# EAGLE design Callisto_Teknic_MSO_LED_out (EAGLE 9.6.2)
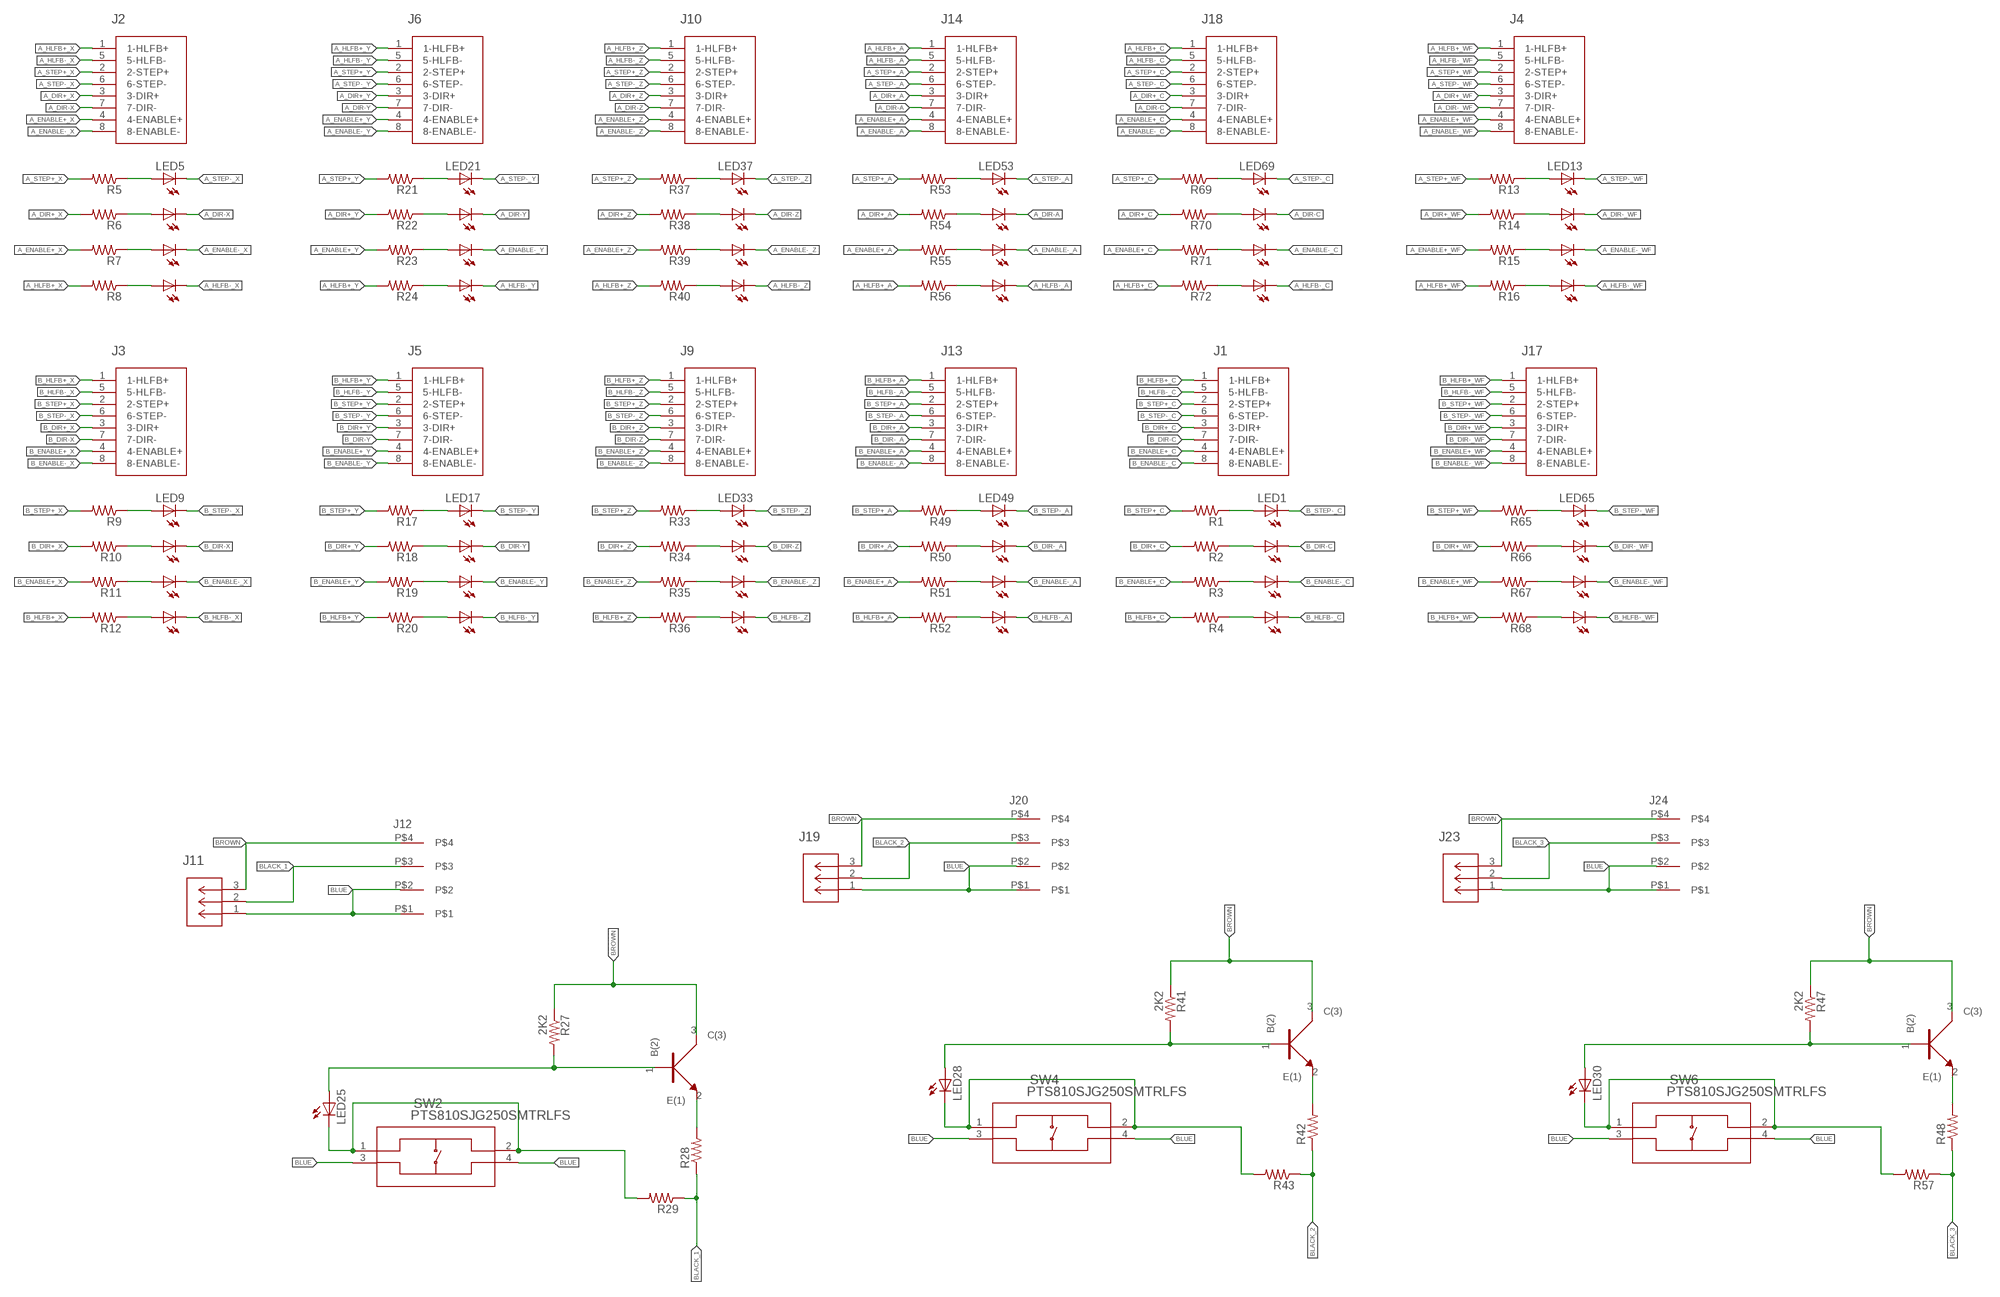
[diagram p0: schematic, sheet 1, part 1 of 2]
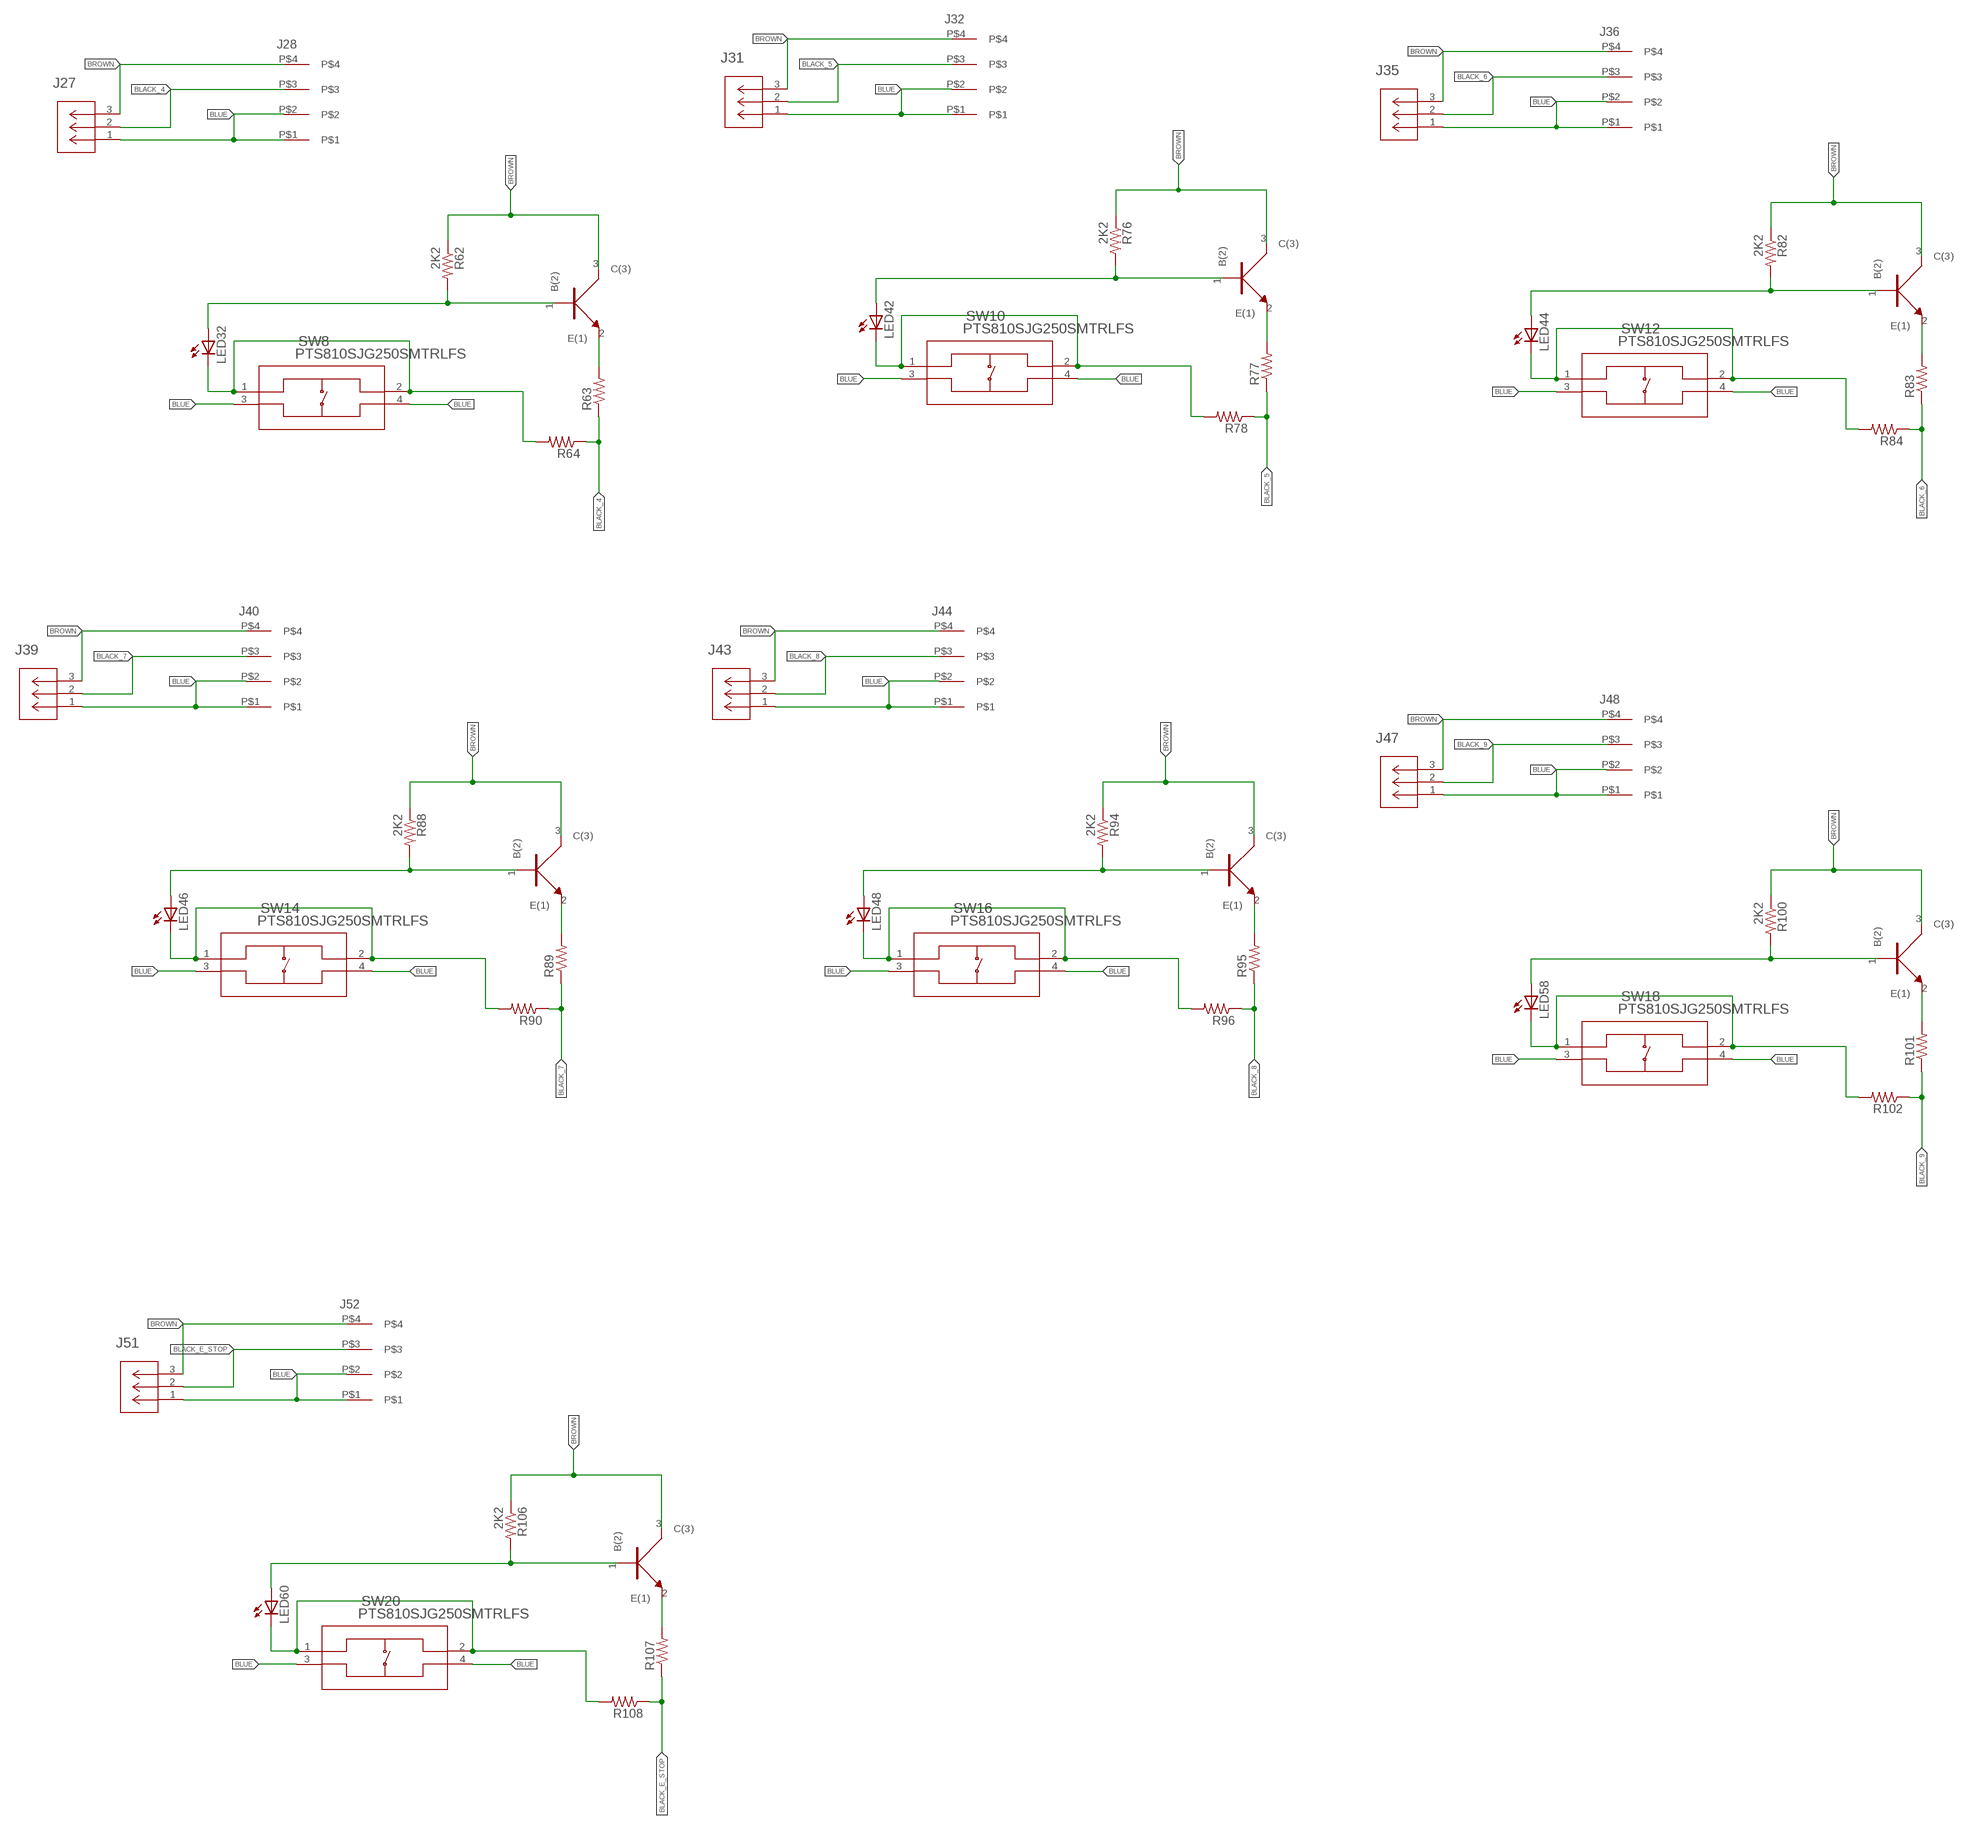
[diagram p1: schematic, sheet 1, part 2 of 2]

## Parts
J1  TEKNIC_MOTOR_SD_8PIN  [CON_39281083]
J2  TEKNIC_MOTOR_SD_8PIN  [CON_39281083]
J3  TEKNIC_MOTOR_SD_8PIN  [CON_39281083]
J4  TEKNIC_MOTOR_SD_8PIN  [CON_39281083]
J5  TEKNIC_MOTOR_SD_8PIN  [CON_39281083]
J6  TEKNIC_MOTOR_SD_8PIN  [CON_39281083]
J9  TEKNIC_MOTOR_SD_8PIN  [CON_39281083]
J10  TEKNIC_MOTOR_SD_8PIN  [CON_39281083]
J11  CONN_530470310_PICOBLADE_X_3  [CON_530470310_MOL]
J12  4-pos  3.81MM_1_X_4_RT_ANGLE_PLUG_HEADER  [1X4_3.81MM_PITCH]
J13  TEKNIC_MOTOR_SD_8PIN  [CON_39281083]
J14  TEKNIC_MOTOR_SD_8PIN  [CON_39281083]
J17  TEKNIC_MOTOR_SD_8PIN  [CON_39281083]
J18  TEKNIC_MOTOR_SD_8PIN  [CON_39281083]
J19  CONN_530470310_PICOBLADE_X_3  [CON_530470310_MOL]
J20  4-pos  3.81MM_1_X_4_RT_ANGLE_PLUG_HEADER  [1X4_3.81MM_PITCH]
J23  CONN_530470310_PICOBLADE_X_3  [CON_530470310_MOL]
J24  4-pos  3.81MM_1_X_4_RT_ANGLE_PLUG_HEADER  [1X4_3.81MM_PITCH]
J27  CONN_530470310_PICOBLADE_X_3  [CON_530470310_MOL]
J28  4-pos  3.81MM_1_X_4_RT_ANGLE_PLUG_HEADER  [1X4_3.81MM_PITCH]
J31  CONN_530470310_PICOBLADE_X_3  [CON_530470310_MOL]
J32  4-pos  3.81MM_1_X_4_RT_ANGLE_PLUG_HEADER  [1X4_3.81MM_PITCH]
J35  CONN_530470310_PICOBLADE_X_3  [CON_530470310_MOL]
J36  4-pos  3.81MM_1_X_4_RT_ANGLE_PLUG_HEADER  [1X4_3.81MM_PITCH]
J39  CONN_530470310_PICOBLADE_X_3  [CON_530470310_MOL]
J40  4-pos  3.81MM_1_X_4_RT_ANGLE_PLUG_HEADER  [1X4_3.81MM_PITCH]
J43  CONN_530470310_PICOBLADE_X_3  [CON_530470310_MOL]
J44  4-pos  3.81MM_1_X_4_RT_ANGLE_PLUG_HEADER  [1X4_3.81MM_PITCH]
J47  CONN_530470310_PICOBLADE_X_3  [CON_530470310_MOL]
J48  4-pos  3.81MM_1_X_4_RT_ANGLE_PLUG_HEADER  [1X4_3.81MM_PITCH]
J51  CONN_530470310_PICOBLADE_X_3  [CON_530470310_MOL]
J52  4-pos  3.81MM_1_X_4_RT_ANGLE_PLUG_HEADER  [1X4_3.81MM_PITCH]
LED1  Green  LED_0805_GREEN  [0805]
LED2  Green  LED_0805_GREEN  [0805]
LED3  Green  LED_0805_GREEN  [0805]
LED4  Green  LED_0805_GREEN  [0805]
LED5  Green  LED_0805_GREEN  [0805]
LED6  Green  LED_0805_GREEN  [0805]
LED7  Green  LED_0805_GREEN  [0805]
LED8  Green  LED_0805_GREEN  [0805]
LED9  Green  LED_0805_GREEN  [0805]
LED10  Green  LED_0805_GREEN  [0805]
LED11  Green  LED_0805_GREEN  [0805]
LED12  Green  LED_0805_GREEN  [0805]
LED13  Green  LED_0805_GREEN  [0805]
LED14  Green  LED_0805_GREEN  [0805]
LED15  Green  LED_0805_GREEN  [0805]
LED16  Green  LED_0805_GREEN  [0805]
LED17  Green  LED_0805_GREEN  [0805]
LED18  Green  LED_0805_GREEN  [0805]
LED19  Green  LED_0805_GREEN  [0805]
LED20  Green  LED_0805_GREEN  [0805]
LED21  Green  LED_0805_GREEN  [0805]
LED22  Green  LED_0805_GREEN  [0805]
LED23  Green  LED_0805_GREEN  [0805]
LED24  Green  LED_0805_GREEN  [0805]
LED25  Green  LED_0805_GREEN  [0805]
LED28  Green  LED_0805_GREEN  [0805]
LED30  Green  LED_0805_GREEN  [0805]
LED32  Green  LED_0805_GREEN  [0805]
LED33  Green  LED_0805_GREEN  [0805]
LED34  Green  LED_0805_GREEN  [0805]
LED35  Green  LED_0805_GREEN  [0805]
LED36  Green  LED_0805_GREEN  [0805]
LED37  Green  LED_0805_GREEN  [0805]
LED38  Green  LED_0805_GREEN  [0805]
LED39  Green  LED_0805_GREEN  [0805]
LED40  Green  LED_0805_GREEN  [0805]
LED42  Green  LED_0805_GREEN  [0805]
LED44  Green  LED_0805_GREEN  [0805]
LED46  Green  LED_0805_GREEN  [0805]
LED48  Green  LED_0805_GREEN  [0805]
LED49  Green  LED_0805_GREEN  [0805]
LED50  Green  LED_0805_GREEN  [0805]
LED51  Green  LED_0805_GREEN  [0805]
LED52  Green  LED_0805_GREEN  [0805]
LED53  Green  LED_0805_GREEN  [0805]
LED54  Green  LED_0805_GREEN  [0805]
LED55  Green  LED_0805_GREEN  [0805]
LED56  Green  LED_0805_GREEN  [0805]
LED58  Green  LED_0805_GREEN  [0805]
LED60  Green  LED_0805_GREEN  [0805]
LED65  Green  LED_0805_GREEN  [0805]
LED66  Green  LED_0805_GREEN  [0805]
LED67  Green  LED_0805_GREEN  [0805]
LED68  Green  LED_0805_GREEN  [0805]
LED69  Green  LED_0805_GREEN  [0805]
LED70  Green  LED_0805_GREEN  [0805]
LED71  Green  LED_0805_GREEN  [0805]
LED72  Green  LED_0805_GREEN  [0805]
R1  R_0805  [0805]
R2  R_0805  [0805]
R3  R_0805  [0805]
R4  R_0805  [0805]
R5  R_0805  [0805]
R6  R_0805  [0805]
R7  R_0805  [0805]
R8  R_0805  [0805]
R9  R_0805  [0805]
R10  R_0805  [0805]
R11  R_0805  [0805]
R12  R_0805  [0805]
R13  R_0805  [0805]
R14  R_0805  [0805]
R15  R_0805  [0805]
R16  R_0805  [0805]
R17  R_0805  [0805]
R18  R_0805  [0805]
R19  R_0805  [0805]
R20  R_0805  [0805]
R21  R_0805  [0805]
R22  R_0805  [0805]
R23  R_0805  [0805]
R24  R_0805  [0805]
R27  2K2  R_0402  [0402]
R28  R_0402  [0402]
R29  R_0402  [0402]
R33  R_0805  [0805]
R34  R_0805  [0805]
R35  R_0805  [0805]
R36  R_0805  [0805]
R37  R_0805  [0805]
R38  R_0805  [0805]
R39  R_0805  [0805]
R40  R_0805  [0805]
R41  2K2  R_0402  [0402]
R42  R_0402  [0402]
R43  R_0402  [0402]
R47  2K2  R_0402  [0402]
R48  R_0402  [0402]
R49  R_0805  [0805]
R50  R_0805  [0805]
R51  R_0805  [0805]
R52  R_0805  [0805]
R53  R_0805  [0805]
R54  R_0805  [0805]
R55  R_0805  [0805]
R56  R_0805  [0805]
R57  R_0402  [0402]
R62  2K2  R_0402  [0402]
R63  R_0402  [0402]
R64  R_0402  [0402]
R65  R_0805  [0805]
R66  R_0805  [0805]
R67  R_0805  [0805]
R68  R_0805  [0805]
R69  R_0805  [0805]
R70  R_0805  [0805]
R71  R_0805  [0805]
R72  R_0805  [0805]
R76  2K2  R_0402  [0402]
R77  R_0402  [0402]
R78  R_0402  [0402]
R82  2K2  R_0402  [0402]
R83  R_0402  [0402]
R84  R_0402  [0402]
R88  2K2  R_0402  [0402]
R89  R_0402  [0402]
R90  R_0402  [0402]
R94  2K2  R_0402  [0402]
R95  R_0402  [0402]
R96  R_0402  [0402]
R100  2K2  R_0402  [0402]
R101  R_0402  [0402]
R102  R_0402  [0402]
R106  2K2  R_0402  [0402]
R107  R_0402  [0402]
R108  R_0402  [0402]
SW2  PTS810SJG250SMTRLFS  [PTS810]
SW4  PTS810SJG250SMTRLFS  [PTS810]
SW6  PTS810SJG250SMTRLFS  [PTS810]
SW8  PTS810SJG250SMTRLFS  [PTS810]
SW10  PTS810SJG250SMTRLFS  [PTS810]
SW12  PTS810SJG250SMTRLFS  [PTS810]
SW14  PTS810SJG250SMTRLFS  [PTS810]
SW16  PTS810SJG250SMTRLFS  [PTS810]
SW18  PTS810SJG250SMTRLFS  [PTS810]
SW20  PTS810SJG250SMTRLFS  [PTS810]
U1  NPN  BC846BW  [SOT323]
U3  NPN  BC846BW  [SOT323]
U5  NPN  BC846BW  [SOT323]
U7  NPN  BC846BW  [SOT323]
U9  NPN  BC846BW  [SOT323]
U11  NPN  BC846BW  [SOT323]
U13  NPN  BC846BW  [SOT323]
U15  NPN  BC846BW  [SOT323]
U17  NPN  BC846BW  [SOT323]
U20  NPN  BC846BW  [SOT323]

## Nets
A_DIR+_A: J14.3(3-DIR+) R54.2
A_DIR+_C: J18.3(3-DIR+) R70.2
A_DIR+_WF: J4.3(3-DIR+) R14.2
A_DIR+_X: J2.3(3-DIR+) R6.2
A_DIR+_Y: J6.3(3-DIR+) R22.2
A_DIR+_Z: J10.3(3-DIR+) R38.2
A_DIR-_WF: J4.7(7-DIR-) LED14.2(C)
A_DIR-A: J14.7(7-DIR-) LED54.2(C)
A_DIR-C: J18.7(7-DIR-) LED70.2(C)
A_DIR-X: J2.7(7-DIR-) LED6.2(C)
A_DIR-Y: J6.7(7-DIR-) LED22.2(C)
A_DIR-Z: J10.7(7-DIR-) LED38.2(C)
A_ENABLE+_A: J14.4(4-ENABLE+) R55.2
A_ENABLE+_C: J18.4(4-ENABLE+) R71.2
A_ENABLE+_WF: J4.4(4-ENABLE+) R15.2
A_ENABLE+_X: J2.4(4-ENABLE+) R7.2
A_ENABLE+_Y: J6.4(4-ENABLE+) R23.2
A_ENABLE+_Z: J10.4(4-ENABLE+) R39.2
A_ENABLE-_A: J14.8(8-ENABLE-) LED55.2(C)
A_ENABLE-_C: J18.8(8-ENABLE-) LED71.2(C)
A_ENABLE-_WF: J4.8(8-ENABLE-) LED15.2(C)
A_ENABLE-_X: J2.8(8-ENABLE-) LED7.2(C)
A_ENABLE-_Y: J6.8(8-ENABLE-) LED23.2(C)
A_ENABLE-_Z: J10.8(8-ENABLE-) LED39.2(C)
A_HLFB+_A: J14.1(1-HLFB+) R56.2
A_HLFB+_C: J18.1(1-HLFB+) R72.2
A_HLFB+_WF: J4.1(1-HLFB+) R16.2
A_HLFB+_X: J2.1(1-HLFB+) R8.2
A_HLFB+_Y: J6.1(1-HLFB+) R24.2
A_HLFB+_Z: J10.1(1-HLFB+) R40.2
A_HLFB-_A: J14.5(5-HLFB-) LED56.2(C)
A_HLFB-_C: J18.5(5-HLFB-) LED72.2(C)
A_HLFB-_WF: J4.5(5-HLFB-) LED16.2(C)
A_HLFB-_X: J2.5(5-HLFB-) LED8.2(C)
A_HLFB-_Y: J6.5(5-HLFB-) LED24.2(C)
A_HLFB-_Z: J10.5(5-HLFB-) LED40.2(C)
A_STEP+_A: J14.2(2-STEP+) R53.2
A_STEP+_C: J18.2(2-STEP+) R69.2
A_STEP+_WF: J4.2(2-STEP+) R13.2
A_STEP+_X: J2.2(2-STEP+) R5.2
A_STEP+_Y: J6.2(2-STEP+) R21.2
A_STEP+_Z: J10.2(2-STEP+) R37.2
A_STEP-_A: J14.6(6-STEP-) LED53.2(C)
A_STEP-_C: J18.6(6-STEP-) LED69.2(C)
A_STEP-_WF: J4.6(6-STEP-) LED13.2(C)
A_STEP-_X: J2.6(6-STEP-) LED5.2(C)
A_STEP-_Y: J6.6(6-STEP-) LED21.2(C)
A_STEP-_Z: J10.6(6-STEP-) LED37.2(C)
B_DIR+_A: J13.3(3-DIR+) R50.2
B_DIR+_C: J1.3(3-DIR+) R2.2
B_DIR+_WF: J17.3(3-DIR+) R66.2
B_DIR+_X: J3.3(3-DIR+) R10.2
B_DIR+_Y: J5.3(3-DIR+) R18.2
B_DIR+_Z: J9.3(3-DIR+) R34.2
B_DIR-_A: J13.7(7-DIR-) LED50.2(C)
B_DIR-_WF: J17.7(7-DIR-) LED66.2(C)
B_DIR-C: J1.7(7-DIR-) LED2.2(C)
B_DIR-X: J3.7(7-DIR-) LED10.2(C)
B_DIR-Y: J5.7(7-DIR-) LED18.2(C)
B_DIR-Z: J9.7(7-DIR-) LED34.2(C)
B_ENABLE+_A: J13.4(4-ENABLE+) R51.2
B_ENABLE+_C: J1.4(4-ENABLE+) R3.2
B_ENABLE+_WF: J17.4(4-ENABLE+) R67.2
B_ENABLE+_X: J3.4(4-ENABLE+) R11.2
B_ENABLE+_Y: J5.4(4-ENABLE+) R19.2
B_ENABLE+_Z: J9.4(4-ENABLE+) R35.2
B_ENABLE-_A: J13.8(8-ENABLE-) LED51.2(C)
B_ENABLE-_C: J1.8(8-ENABLE-) LED3.2(C)
B_ENABLE-_WF: J17.8(8-ENABLE-) LED67.2(C)
B_ENABLE-_X: J3.8(8-ENABLE-) LED11.2(C)
B_ENABLE-_Y: J5.8(8-ENABLE-) LED19.2(C)
B_ENABLE-_Z: J9.8(8-ENABLE-) LED35.2(C)
B_HLFB+_A: J13.1(1-HLFB+) R52.2
B_HLFB+_C: J1.1(1-HLFB+) R4.2
B_HLFB+_WF: J17.1(1-HLFB+) R68.2
B_HLFB+_X: J3.1(1-HLFB+) R12.2
B_HLFB+_Y: J5.1(1-HLFB+) R20.2
B_HLFB+_Z: J9.1(1-HLFB+) R36.2
B_HLFB-_A: J13.5(5-HLFB-) LED52.2(C)
B_HLFB-_C: J1.5(5-HLFB-) LED4.2(C)
B_HLFB-_WF: J17.5(5-HLFB-) LED68.2(C)
B_HLFB-_X: J3.5(5-HLFB-) LED12.2(C)
B_HLFB-_Y: J5.5(5-HLFB-) LED20.2(C)
B_HLFB-_Z: J9.5(5-HLFB-) LED36.2(C)
B_STEP+_A: J13.2(2-STEP+) R49.2
B_STEP+_C: J1.2(2-STEP+) R1.2
B_STEP+_WF: J17.2(2-STEP+) R65.2
B_STEP+_X: J3.2(2-STEP+) R9.2
B_STEP+_Y: J5.2(2-STEP+) R17.2
B_STEP+_Z: J9.2(2-STEP+) R33.2
B_STEP-_A: J13.6(6-STEP-) LED49.2(C)
B_STEP-_C: J1.6(6-STEP-) LED1.2(C)
B_STEP-_WF: J17.6(6-STEP-) LED65.2(C)
B_STEP-_X: J3.6(6-STEP-) LED9.2(C)
B_STEP-_Y: J5.6(6-STEP-) LED17.2(C)
B_STEP-_Z: J9.6(6-STEP-) LED33.2(C)
BLACK_1: J11.2 J12.P$3 R28.P$1 R29.P$1
BLACK_2: J19.2 J20.P$3 R42.P$1 R43.P$1
BLACK_3: J23.2 J24.P$3 R48.P$1 R57.P$1
BLACK_4: J27.2 J28.P$3 R63.P$1 R64.P$1
BLACK_5: J31.2 J32.P$3 R77.P$1 R78.P$1
BLACK_6: J35.2 J36.P$3 R83.P$1 R84.P$1
BLACK_7: J39.2 J40.P$3 R89.P$1 R90.P$1
BLACK_8: J43.2 J44.P$3 R95.P$1 R96.P$1
BLACK_9: J47.2 J48.P$3 R101.P$1 R102.P$1
BLACK_E_STOP: J51.2 J52.P$3 R107.P$1 R108.P$1
BLUE: J11.1 J12.P$1 J12.P$2 J19.1 J20.P$1 J20.P$2 J23.1 J24.P$1 J24.P$2 J27.1 J28.P$1 J28.P$2 J31.1 J32.P$1 J32.P$2 J35.1 J36.P$1 J36.P$2 J39.1 J40.P$1 J40.P$2 J43.1 J44.P$1 J44.P$2 J47.1 J48.P$1 J48.P$2 J51.1 J52.P$1 J52.P$2 SW2.3 SW2.4 SW4.3 SW4.4 SW6.3 SW6.4 SW8.3 SW8.4 SW10.3 SW10.4 SW12.3 SW12.4 SW14.3 SW14.4 SW16.3 SW16.4 SW18.3 SW18.4 SW20.3 SW20.4
BROWN: J11.3 J12.P$4 J19.3 J20.P$4 J23.3 J24.P$4 J27.3 J28.P$4 J31.3 J32.P$4 J35.3 J36.P$4 J39.3 J40.P$4 J43.3 J44.P$4 J47.3 J48.P$4 J51.3 J52.P$4 R27.P$1 R41.P$1 R47.P$1 R62.P$1 R76.P$1 R82.P$1 R88.P$1 R94.P$1 R100.P$1 R106.P$1 U1.3(C(3)) U3.3(C(3)) U5.3(C(3)) U7.3(C(3)) U9.3(C(3)) U11.3(C(3)) U13.3(C(3)) U15.3(C(3)) U17.3(C(3)) U20.3(C(3))
N$1: LED1.1(A) R1.1
N$2: LED2.1(A) R2.1
N$3: LED3.1(A) R3.1
N$4: LED4.1(A) R4.1
N$5: LED5.1(A) R5.1
N$6: LED6.1(A) R6.1
N$7: LED7.1(A) R7.1
N$8: LED8.1(A) R8.1
N$9: LED9.1(A) R9.1
N$10: LED10.1(A) R10.1
N$11: LED11.1(A) R11.1
N$12: LED12.1(A) R12.1
N$13: LED13.1(A) R13.1
N$14: LED14.1(A) R14.1
N$15: LED15.1(A) R15.1
N$16: LED16.1(A) R16.1
N$17: LED17.1(A) R17.1
N$18: LED18.1(A) R18.1
N$19: LED19.1(A) R19.1
N$20: LED20.1(A) R20.1
N$21: LED21.1(A) R21.1
N$22: LED22.1(A) R22.1
N$23: LED23.1(A) R23.1
N$24: LED24.1(A) R24.1
N$28: LED25.1(A) R27.P$2 U1.1(B(2))
N$29: LED25.2(C) R29.P$2 SW2.1 SW2.2
N$30: R28.P$2 U1.2(E(1))
N$33: LED33.1(A) R33.1
N$34: LED34.1(A) R34.1
N$35: LED35.1(A) R35.1
N$36: LED36.1(A) R36.1
N$37: LED37.1(A) R37.1
N$38: LED38.1(A) R38.1
N$39: LED39.1(A) R39.1
N$40: LED40.1(A) R40.1
N$42: LED28.1(A) R41.P$2 U3.1(B(2))
N$43: LED28.2(C) R43.P$2 SW4.1 SW4.2
N$44: R42.P$2 U3.2(E(1))
N$48: LED30.1(A) R47.P$2 U5.1(B(2))
N$49: LED49.1(A) R49.1
N$50: LED50.1(A) R50.1
N$51: LED51.1(A) R51.1
N$52: LED52.1(A) R52.1
N$53: LED53.1(A) R53.1
N$54: LED54.1(A) R54.1
N$55: LED55.1(A) R55.1
N$56: LED56.1(A) R56.1
N$57: LED30.2(C) R57.P$2 SW6.1 SW6.2
N$58: R48.P$2 U5.2(E(1))
N$62: LED32.1(A) R62.P$2 U7.1(B(2))
N$63: LED32.2(C) R64.P$2 SW8.1 SW8.2
N$64: R63.P$2 U7.2(E(1))
N$65: LED65.1(A) R65.1
N$66: LED66.1(A) R66.1
N$67: LED67.1(A) R67.1
N$68: LED68.1(A) R68.1
N$69: LED69.1(A) R69.1
N$70: LED70.1(A) R70.1
N$71: LED71.1(A) R71.1
N$72: LED72.1(A) R72.1
N$76: LED42.1(A) R76.P$2 U9.1(B(2))
N$77: LED42.2(C) R78.P$2 SW10.1 SW10.2
N$78: R77.P$2 U9.2(E(1))
N$82: LED44.1(A) R82.P$2 U11.1(B(2))
N$83: LED44.2(C) R84.P$2 SW12.1 SW12.2
N$84: R83.P$2 U11.2(E(1))
N$88: LED46.1(A) R88.P$2 U13.1(B(2))
N$89: LED46.2(C) R90.P$2 SW14.1 SW14.2
N$90: R89.P$2 U13.2(E(1))
N$94: LED48.1(A) R94.P$2 U15.1(B(2))
N$95: LED48.2(C) R96.P$2 SW16.1 SW16.2
N$96: R95.P$2 U15.2(E(1))
N$100: LED58.1(A) R100.P$2 U17.1(B(2))
N$101: LED58.2(C) R102.P$2 SW18.1 SW18.2
N$102: R101.P$2 U17.2(E(1))
N$106: LED60.1(A) R106.P$2 U20.1(B(2))
N$107: LED60.2(C) R108.P$2 SW20.1 SW20.2
N$108: R107.P$2 U20.2(E(1))

## Library data of the parts
J1-J6 J9 J10 J13 J14 J17 J18 = 3D_MIG_Controller:TEKNIC_MOTOR_SD_8PIN; COPYRIGHT: Copyright (C) 2022 Ultra Librarian. All rights reserved.; MANUFACTURER_PART_NUMBER: 39281083; MFR_NAME: Molex Connector Corporation
J11 J19 J23 J27 J31 J35 J39 J43 J47 J51 = 3D_MIG_Controller:CONN_530470310_PICOBLADE_X_3; COPYRIGHT: Copyright (C) 2022 Ultra Librarian. All rights reserved.; MANUFACTURER_PART_NUMBER: 530470310; MFR_NAME: Molex Connector Corporation
J12 J20 J24 J28 J32 J36 J40 J44 J48 J52 = 3D_MIG_Controller:3.81MM_1_X_4_RT_ANGLE_PLUG_HEADER: 4 Position Terminal Block Header, Male Pins, Shrouded (4 Side) 0.150" (3.81mm) 90°, Right Angle - Through Hole; PARTNO: 691322310004
LED1-LED25 LED28 LED30 LED32-LED40 LED42 LED44 LED46 LED48-LED56 LED58 LED60 LED65-LED72 = 3D_MIG_Controller:LED_0805_GREEN: Green 570nm LED Indication - Discrete 2.2V 0805 (2012 Metric); PARTNO: LG R971-KN-1
R1-R24 R33-R40 R49-R56 R65-R72 = 3D_MIG_Controller:R_0805
R27-R29 R41-R43 R47 R48 R57 R62-R64 R76-R78 R82-R84 R88-R90 R94-R96 R100-R102 R106-R108 = 3D_MIG_Controller:R_0402
SW2 SW4 SW6 SW8 SW10 SW12 SW14 SW16 SW18 SW20 = 3D_MIG_Controller:PTS810SJG250SMTRLFS; BUILT_BY: EMA_Cory; COPYRIGHT: Copyright (C) 2018 Accelerated Designs. All rights reserved; DATASHEET: https://www.ckswitches.com/products/tactile/PTS810/#PTS810SJG250SMTRLFS; MANUFACTURER_PART_NUMBER: PTS810SJG250SMTRLFS; VENDOR: C&K
U1 U3 U5 U7 U9 U11 U13 U15 U17 U20 = 3D_MIG_Controller:BC846BW: Bipolar (BJT) Transistor NPN 100MHz Surface Mount SOT-323; PARTNO: BC846BW_NPN

## Board
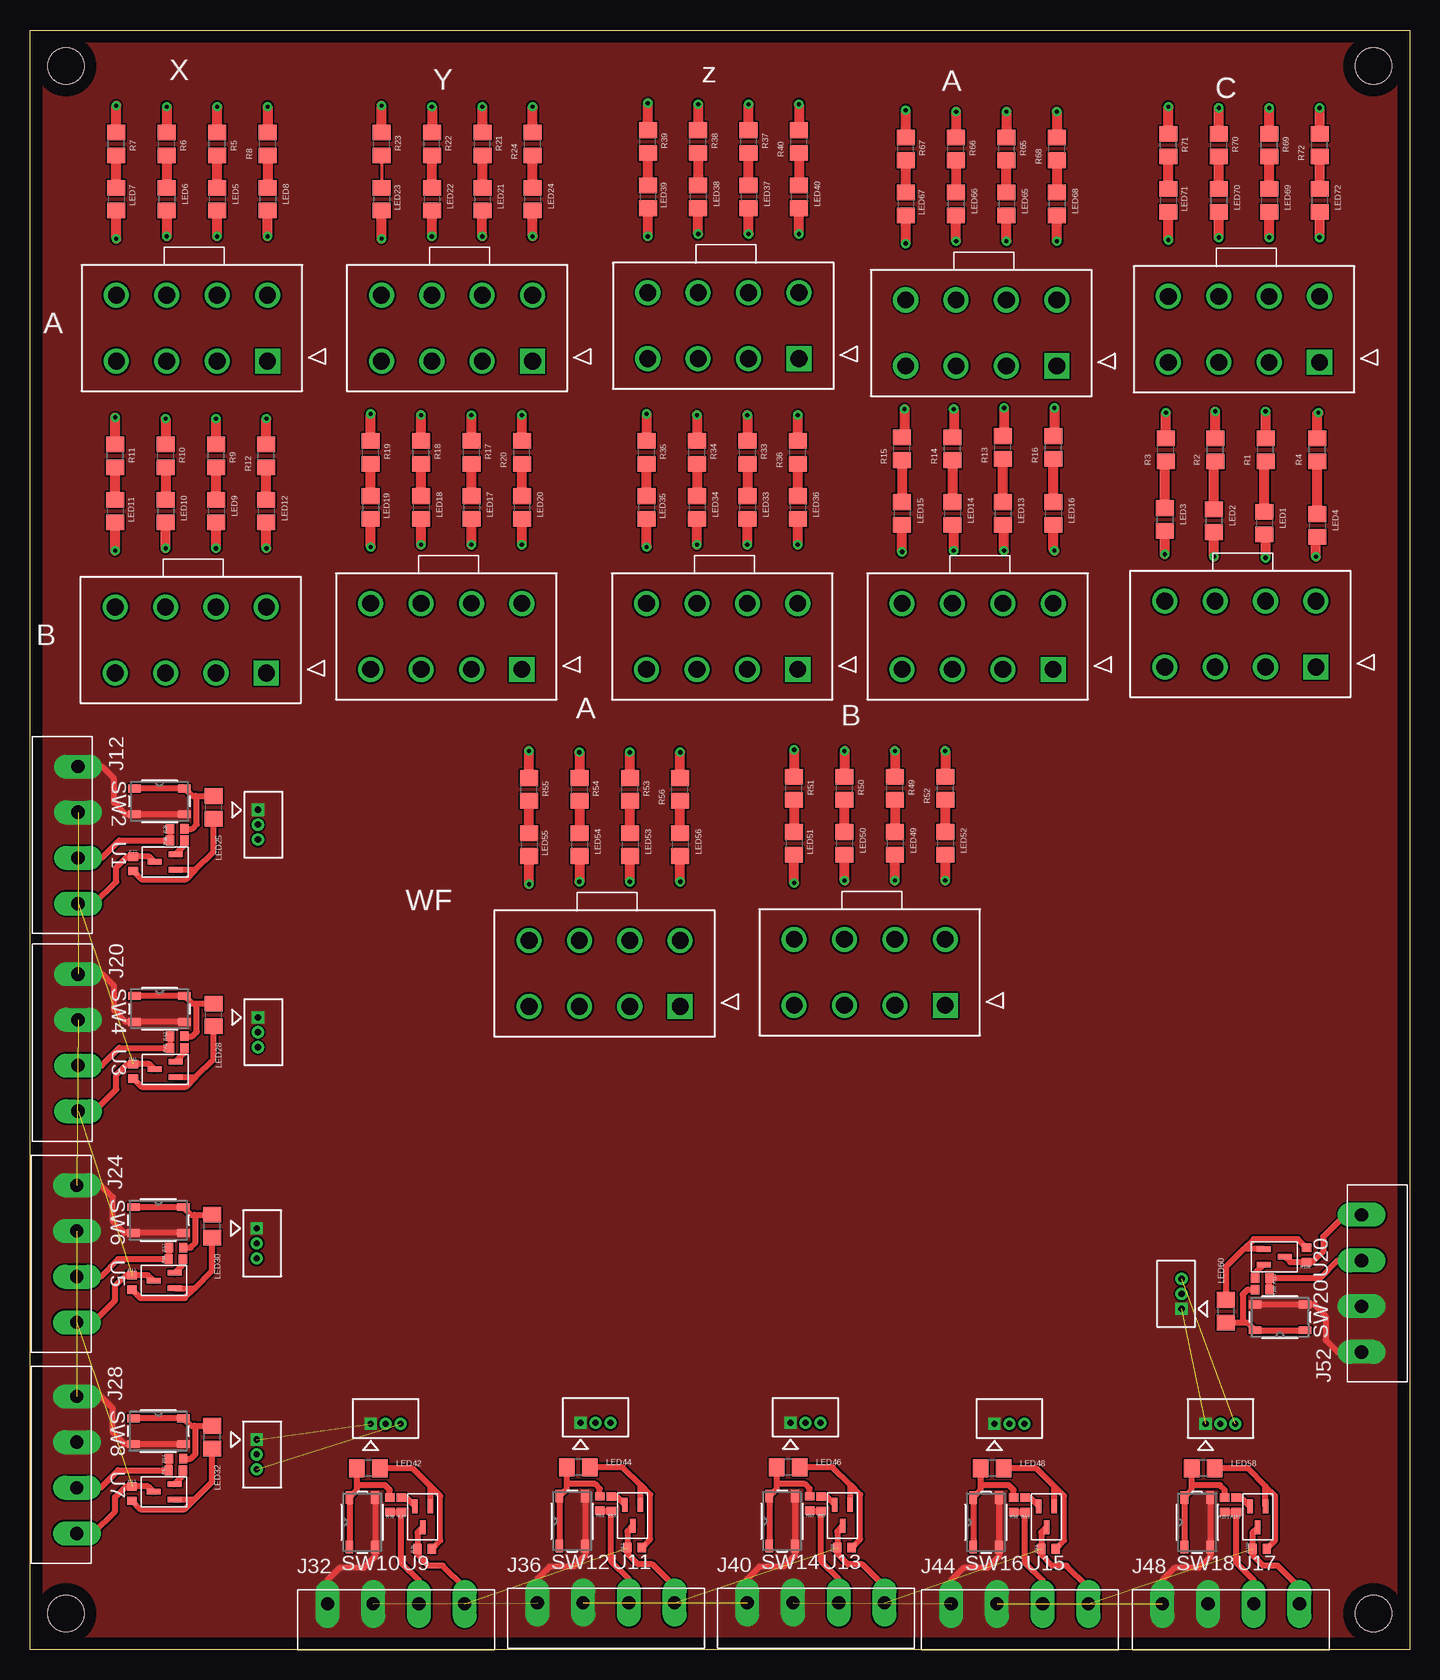
[diagram p2: board, top side]
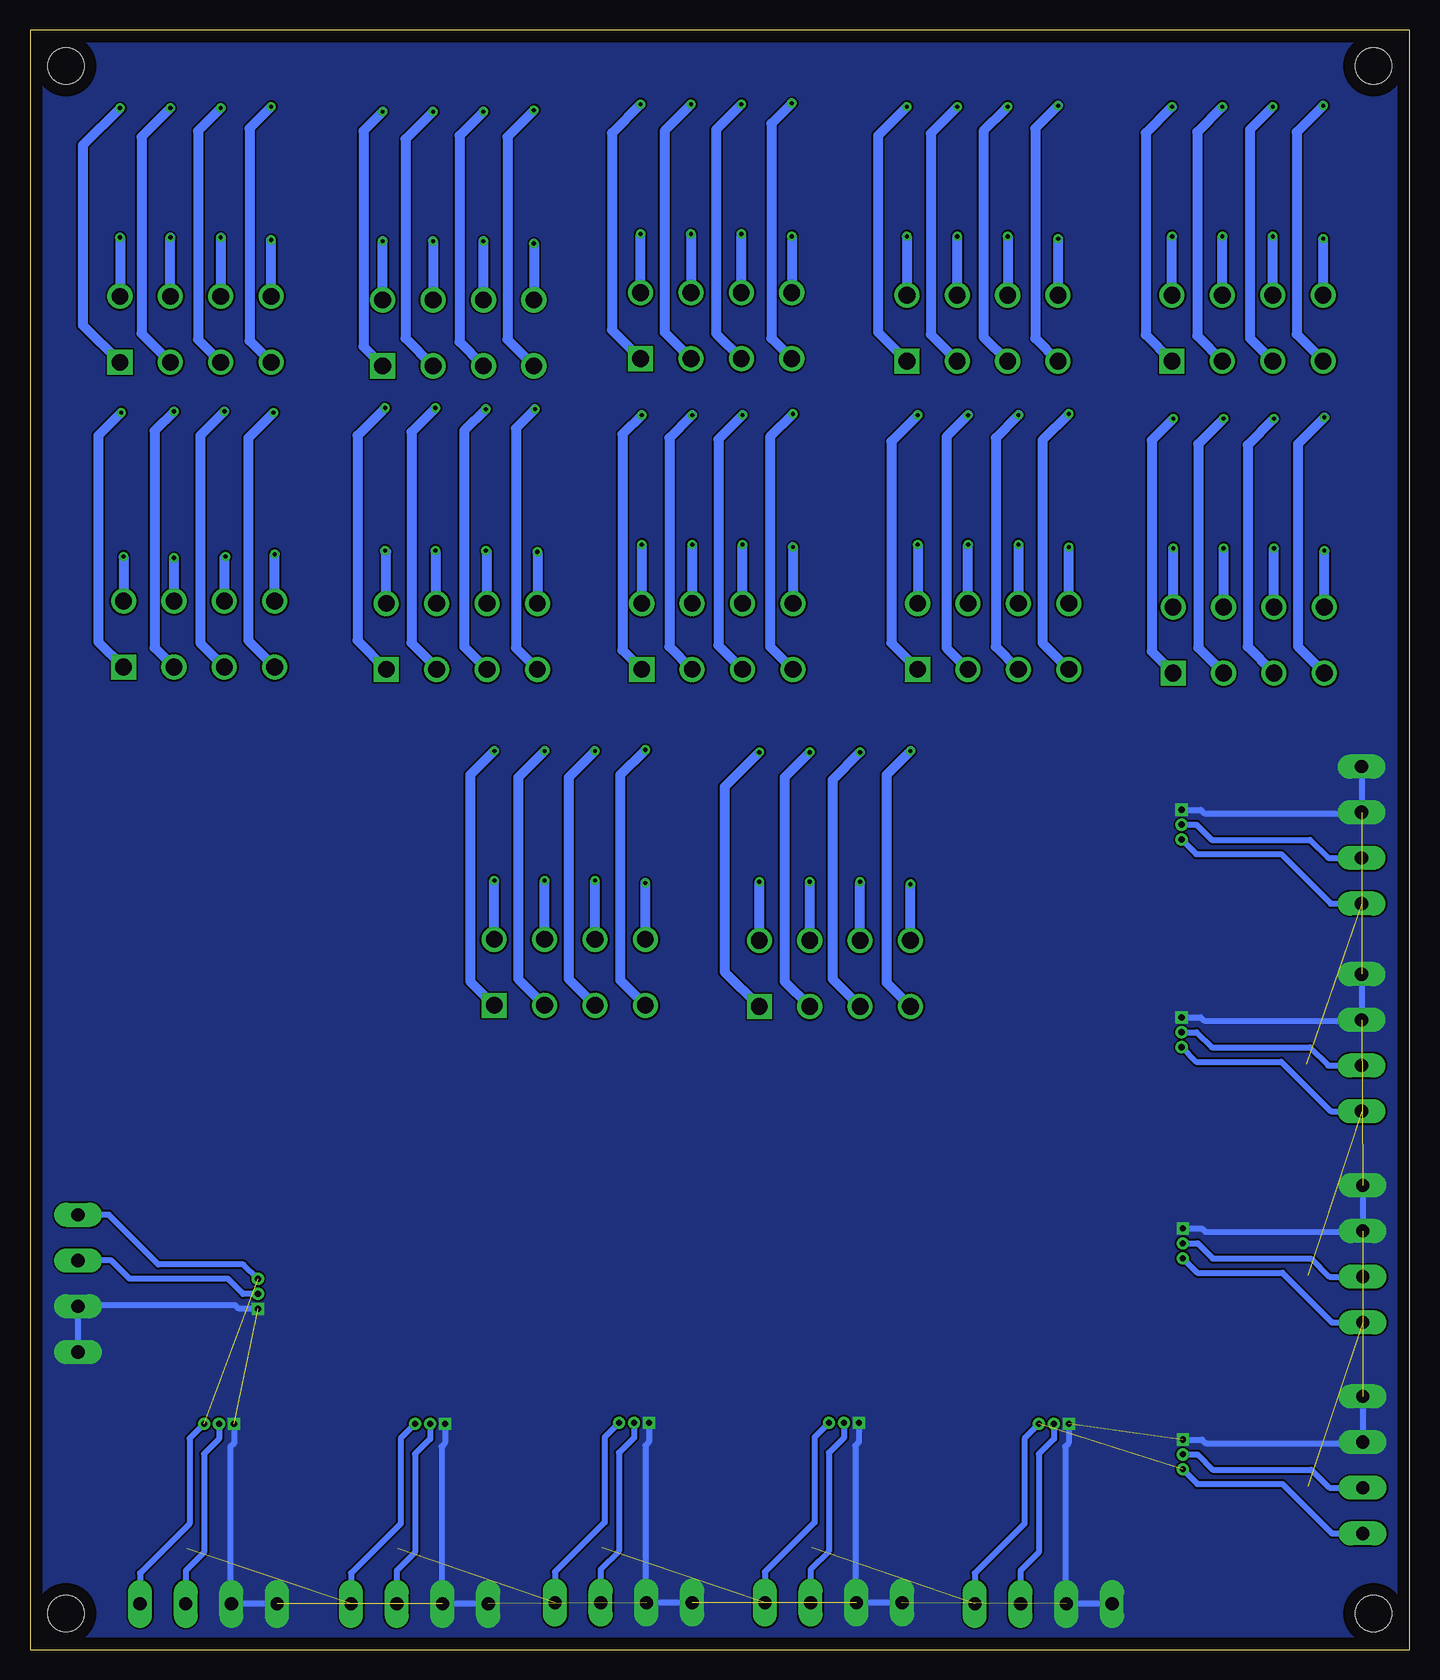
[diagram p3: board, bottom side, seen from below]

Size 115 x 135 mm. Coordinates in mm from the lower left corner, seen from the top.
Outline: 0,0 0,135 115,135 115,0 0,0
Copper layers (1*16): Top 0.035mm / dielectric 1.5mm / Bottom 0.035mm
Design rules "default": minimum track width 6mil, minimum drill 0.35mm, track to track 6mil, track to pad 6mil, pad to pad 6mil, via to via 6mil, smd to smd 6mil, copper to edge 40mil, drill to drill 6mil, minimum pad ring 10mil, minimum via ring 8mil, stop-mask expansion 4mil, vias tented up to drill 0mil, thermal gap 10mil
Holes 3 mm at 3,3 112,3 112,132 3,132

### Footprints (pad centres in the part's own frame; a part is rotated, then mirrored left to right if it is on the bottom)
CON_39281083 = drill 1.397 pad 1.905 square: 1 12.6,-5.5 | drill 1.397 pad 1.905: 2 8.4,-5.5; 3 4.2,-5.5; 4 0,-5.5; 5 12.6,0; 6 8.4,0; 7 4.2,0; 8 0,0
CON_530470310_MOL = drill 0.508 pad 0.838 square: 1 0,0 | drill 0.508 pad 0.838: 2 -1.245,0; 3 -2.489,0
1X4_3.81MM_PITCH = drill 1.1 pad 2 long: P$1 0,0; P$2 3.81,0; P$3 7.62,0; P$4 11.43,0
0805 = smd 1.3 x 1.5: 1 -0.95,0; 2 0.95,0
0402 = smd 0.8 x 0.7: P$1 0,0.6; P$2 0,-0.6
PTS810 = smd 1.041 x 0.66: 1 -2.075,1.075; 2 2.075,1.075; 3 -2.075,-1.075; 4 2.075,-1.075
SOT323 = smd 0.457 x 1.168: 1 -0.65,-0.876; 2 0.65,-0.876; 3 0,0.876

### Placement (x,y rotation side)
J1  94.6,87.4 0 top
J2  7.2,112.9 0 top
J3  7.1,86.9 0 top
J4  72.7,87.2 0 top
J5  28.4,87.2 0 top
J6  29.3,112.9 0 top
J9  51.4,87.2 0 top
J10  51.5,113.1 0 top
J11  19,70 90 top
J12  4,73.6 270 top
J13  63.7,59.2 0 top
J14  41.6,59.1 0 top
J17  73,112.5 0 top
J18  94.9,112.8 0 top
J19  19,52.7 90 top
J20  4,56.3 270 top
J23  18.9,35.1 90 top
J24  3.9,38.7 270 top
J27  18.9,17.5 90 top
J28  3.9,21.1 270 top
J31  28.4,18.8 180 top
J32  24.8,3.8 0 top
J35  45.9,18.9 180 top
J36  42.3,3.9 0 top
J39  63.4,18.9 180 top
J40  59.8,3.9 0 top
J43  80.4,18.8 180 top
J44  76.8,3.8 0 top
J47  98,18.8 180 top
J48  94.4,3.8 0 top
J51  96,28.4 270 top
J52  111,24.8 90 top
LED1  102.9,93.9 270 top
LED2  98.7,94.1 270 top
LED3  94.6,94.2 270 top
LED4  107.3,93.7 270 top
LED5  15.61,120.9 270 top
LED6  11.4,120.9 270 top
LED7  7.2,120.9 270 top
LED8  19.8,120.9 270 top
LED9  15.51,94.9 270 top
LED10  11.3,94.9 270 top
LED11  7.1,94.9 270 top
LED12  19.7,94.9 270 top
LED13  81.1,94.7 270 top
LED14  76.9,94.7 270 top
LED15  72.7,94.7 270 top
LED16  85.3,94.7 270 top
LED17  36.81,95.2 270 top
LED18  32.6,95.2 270 top
LED19  28.4,95.2 270 top
LED20  41,95.2 270 top
LED21  37.71,120.9 270 top
LED22  33.5,120.9 270 top
LED23  29.3,120.9 270 top
LED24  41.9,120.9 270 top
LED25  15.3,70.2 90 top
LED28  15.3,52.9 90 top
LED30  15.2,35.3 90 top
LED32  15.2,17.7 90 top
LED33  59.81,95.2 270 top
LED34  55.6,95.2 270 top
LED35  51.4,95.2 270 top
LED36  64,95.2 270 top
LED37  59.91,121.1 270 top
LED38  55.7,121.1 270 top
LED39  51.5,121.1 270 top
LED40  64.1,121.1 270 top
LED42  28.2,15.1 180 top
LED44  45.7,15.2 180 top
LED46  63.2,15.2 180 top
LED48  80.2,15.1 180 top
LED49  72.11,67.2 270 top
LED50  67.9,67.2 270 top
LED51  63.7,67.2 270 top
LED52  76.3,67.2 270 top
LED53  50.01,67.1 270 top
LED54  45.8,67.1 270 top
LED55  41.6,67.1 270 top
LED56  54.2,67.1 270 top
LED58  97.8,15.1 180 top
LED60  99.7,28.2 270 top
LED65  81.41,120.5 270 top
LED66  77.2,120.5 270 top
LED67  73,120.5 270 top
LED68  85.6,120.5 270 top
LED69  103.31,120.8 270 top
LED70  99.1,120.8 270 top
LED71  94.9,120.8 270 top
LED72  107.5,120.8 270 top
R1  103,100 90 top
R2  98.8,100 90 top
R3  94.7,100 90 top
R4  107.3,100 90 top
R5  15.61,125.5 90 top
R6  11.4,125.5 90 top
R7  7.2,125.5 90 top
R8  19.8,125.5 90 top
R9  15.51,99.5 90 top
R10  11.3,99.5 90 top
R11  7.1,99.5 90 top
R12  19.7,99.5 90 top
R13  81.1,100.2 90 top
R14  76.9,100.1 90 top
R15  72.7,100.1 90 top
R16  85.3,100.2 90 top
R17  36.81,99.8 90 top
R18  32.6,99.8 90 top
R19  28.4,99.8 90 top
R20  41,99.8 90 top
R21  37.71,125.5 90 top
R22  33.5,125.5 90 top
R23  29.3,125.5 90 top
R24  41.9,125.5 90 top
R27  8.6,65.5 0 top
R28  12.26,67.44 90 top
R29  12.27,68.41 90 top
R33  59.81,99.8 90 top
R34  55.6,99.8 90 top
R35  51.4,99.8 90 top
R36  64,99.8 90 top
R37  59.91,125.7 90 top
R38  55.7,125.7 90 top
R39  51.5,125.7 90 top
R40  64.1,125.7 90 top
R41  8.6,48.2 0 top
R42  12.26,50.14 90 top
R43  12.27,51.11 90 top
R47  8.5,30.6 0 top
R48  12.16,32.54 90 top
R49  72.11,71.8 90 top
R50  67.9,71.8 90 top
R51  63.7,71.8 90 top
R52  76.3,71.8 90 top
R53  50.01,71.7 90 top
R54  45.8,71.7 90 top
R55  41.6,71.7 90 top
R56  54.2,71.7 90 top
R57  12.17,33.51 90 top
R62  8.5,13 0 top
R63  12.16,14.94 90 top
R64  12.17,15.91 90 top
R65  81.41,125.1 90 top
R66  77.2,125.1 90 top
R67  73,125.1 90 top
R68  85.6,125.1 90 top
R69  103.31,125.4 90 top
R70  99.1,125.4 90 top
R71  94.9,125.4 90 top
R72  107.5,125.4 90 top
R76  32.9,8.4 90 top
R77  30.96,12.06 180 top
R78  29.99,12.07 180 top
R82  50.4,8.5 90 top
R83  48.46,12.16 180 top
R84  47.49,12.17 180 top
R88  67.9,8.5 90 top
R89  65.96,12.16 180 top
R90  64.99,12.17 180 top
R94  84.9,8.4 90 top
R95  82.96,12.06 180 top
R96  81.99,12.07 180 top
R100  102.5,8.4 90 top
R101  100.56,12.06 180 top
R102  99.59,12.07 180 top
R106  106.4,32.9 180 top
R107  102.74,30.96 270 top
R108  102.73,29.99 270 top
SW2  10.8,70.7 0 top
SW4  10.8,53.4 0 top
SW6  10.7,35.8 0 top
SW8  10.7,18.2 0 top
SW10  27.7,10.6 90 top
SW12  45.2,10.7 90 top
SW14  62.7,10.7 90 top
SW16  79.7,10.6 90 top
SW18  97.3,10.6 90 top
SW20  104.2,27.7 180 top
U1  11.27,65.66 90 top
U3  11.27,48.36 90 top
U5  11.17,30.76 90 top
U7  11.17,13.16 90 top
U9  32.74,11.07 180 top
U11  50.24,11.17 180 top
U13  67.74,11.17 180 top
U15  84.74,11.07 180 top
U17  102.34,11.07 180 top
U20  103.73,32.74 270 top

### Tracks (layer width: path | path; a pad name or v marks a point on that pad's centre or on a via)
A_DIR+_A  (via drill 0.35)
  Top 0.813: v45.8,74.8 R54.2
  Bottom 0.813: J14.3 48.1,55.9 48.1,72.5 v45.8,74.8
A_DIR+_C  (via drill 0.35)
  Top 0.813: R70.2 v99.1,128.5
  Bottom 0.813: J18.3 101,109.2 101,126.6 v99.1,128.5
A_DIR+_WF  (via drill 0.35)
  Top 0.813: v77,103.4 77,101.15 R14.2
  Bottom 0.813: v77,103.4 78.8,101.6 78.8,83.6 J4.3
A_DIR+_X  (via drill 0.35)
  Top 0.254: 11.4,126.7 R6.2
  Top 0.813: v11.4,128.6 11.4,126.7
  Bottom 0.813: v11.4,128.6 13.3,126.7 13.3,109.3 J2.3
A_DIR+_Y  (via drill 0.35)
  Top 0.813: v33.5,128.6 R22.2
  Bottom 0.254: 33.65,128.45 v33.5,128.6
  Bottom 0.813: J6.3 35.51,109.41 35.51,126.59 33.65,128.45
A_DIR+_Z  (via drill 0.35)
  Top 0.813: v55.7,128.8 R38.2
  Bottom 0.813: v55.7,128.8 57.8,126.7 57.8,109.7 J10.3
A_DIR-_WF  (via drill 0.35)
  Top 0.254: 77,93.65 LED14.2
  Top 0.813: v77,91.6 77,93.65
  Bottom 0.813: J4.7 76.9,91.5 v77,91.6
A_DIR-A  (via drill 0.35)
  Top 0.813: LED54.2 v45.8,64
  Bottom 0.254: 45.8,63.9 v45.8,64
  Bottom 0.813: J14.7 45.8,63.9
A_DIR-C  (via drill 0.35)
  Top 0.813: v99.1,117.7 LED70.2
  Bottom 0.813: v99.1,117.7 J18.7
A_DIR-X  (via drill 0.35)
  Top 0.813: LED6.2 v11.4,117.8
  Bottom 0.813: J2.7 v11.4,117.8
A_DIR-Y  (via drill 0.35)
  Top 0.813: v33.5,117.8 LED22.2
  Bottom 0.813: v33.5,117.8 J6.7
A_DIR-Z  (via drill 0.35)
  Top 0.254: 55.7,120.1 LED38.2
  Top 0.813: v55.7,118 55.7,120.1
  Bottom 0.813: J10.7 v55.7,118
A_ENABLE+_A  (via drill 0.35)
  Top 0.813: R55.2 v41.6,74.9
  Bottom 0.813: J14.4 43.6,55.6 43.6,72.9 v41.6,74.9
A_ENABLE+_C  (via drill 0.35)
  Top 0.813: R71.2 v94.9,128.6
  Bottom 0.813: v94.9,128.6 96.7,126.8 96.7,109.1 J18.4
A_ENABLE+_WF  (via drill 0.35)
  Top 0.813: v72.9,103.4 72.9,101.25 R15.2
  Bottom 0.813: v72.9,103.4 74.5,101.8 74.5,83.5 J4.4
A_ENABLE+_X  (via drill 0.35)
  Top 0.813: R7.2 v7.2,128.7
  Bottom 0.813: v7.2,128.7 9.41,126.49 9.41,109.64 7.2,107.43 J2.4
A_ENABLE+_Y  (via drill 0.35)
  Top 0.813: R23.2 v29.3,128.7
  Bottom 0.813: v29.3,128.7 31.21,126.79 31.21,109.31 J6.4
A_ENABLE+_Z  (via drill 0.35)
  Top 0.813: R39.2 v51.5,128.9
  Bottom 0.813: v51.5,128.9 53.2,127.2 53.2,109.3 J10.4
A_ENABLE-_A  (via drill 0.35)
  Top 0.813: v41.6,63.8 LED55.2
  Bottom 0.813: J14.8 v41.6,63.8
A_ENABLE-_C  (via drill 0.35)
  Top 0.813: v94.9,117.5 LED71.2
  Bottom 0.813: J18.8 v94.9,117.5
A_ENABLE-_WF  (via drill 0.35)
  Top 0.813: v72.7,91.5 LED15.2
  Bottom 0.813: v72.7,91.5 J4.8
A_ENABLE-_X  (via drill 0.35)
  Top 0.254: 7.2,119.6 LED7.2
  Top 0.813: v7.2,117.6 7.2,119.6
  Bottom 0.813: J2.8 v7.2,117.6
A_ENABLE-_Y  (via drill 0.35)
  Top 0.813: v29.3,117.6 LED23.2
  Bottom 0.813: v29.3,117.6 J6.8
A_ENABLE-_Z  (via drill 0.35)
  Top 0.813: v51.5,117.8 LED39.2
  Bottom 0.813: v51.5,117.8 J10.8
A_HLFB+_A  (via drill 0.35)
  Top 0.813: R56.2 v54.2,74.8
  Bottom 0.813: J14.1 57.1,56.5 57.1,71.9 v54.2,74.8
A_HLFB+_C  (via drill 0.35)
  Top 0.813: R72.2 v107.5,128.5
  Bottom 0.813: J18.1 110.59,110.39 110.59,125.41 v107.5,128.5
A_HLFB+_WF  (via drill 0.35)
  Top 0.813: v85.4,103.5 85.4,101.25 R16.2
  Bottom 0.813: v85.4,103.5 87.71,101.19 87.71,84.11 J4.1
A_HLFB+_X  (via drill 0.35)
  Top 0.813: v19.8,128.6 R8.2
  Bottom 0.813: J2.1 22,109.6 22,126.4 v19.8,128.6
A_HLFB+_Y  (via drill 0.35)
  Top 0.813: R24.2 v41.9,128.6
  Bottom 0.813: v41.9,128.6 44.3,126.2 44.3,109.8 J6.1
A_HLFB+_Z  (via drill 0.35)
  Top 0.813: v64.1,128.8 R40.2
  Bottom 0.813: v64.1,128.8 66.5,126.4 66.5,110 J10.1
A_HLFB-_A  (via drill 0.35)
  Top 0.813: v54.2,64 LED56.2
  Bottom 0.254: 54.2,63.9 v54.2,64
  Bottom 0.813: J14.5 54.2,63.9
A_HLFB-_C  (via drill 0.35)
  Top 0.813: v107.5,117.7 LED72.2
  Bottom 0.813: v107.5,117.7 J18.5
A_HLFB-_WF  (via drill 0.35)
  Top 0.254: 85.33,93.72 LED16.2
  Top 0.813: v85.4,91.6 85.33,91.67 85.33,93.72
  Bottom 0.813: J4.5 85.3,91.5 v85.4,91.6
A_HLFB-_X  (via drill 0.35)
  Top 0.813: v19.8,117.8 LED8.2
  Bottom 0.813: J2.5 v19.8,117.8
A_HLFB-_Y  (via drill 0.35)
  Top 0.813: v41.9,117.8 LED24.2
  Bottom 0.813: v41.9,117.8 J6.5
A_HLFB-_Z  (via drill 0.35)
  Top 0.813: v64.1,118 LED40.2
  Bottom 0.813: J10.5 v64.1,118
A_STEP+_A  (via drill 0.35)
  Top 0.813: R53.2 v50.01,74.79 v50,74.8
  Bottom 0.813: J14.2 52.1,55.7 52.1,72.7 v50,74.8
A_STEP+_C  (via drill 0.35)
  Top 0.813: R69.2 v103.31,128.49 v103.3,128.5
  Bottom 0.254: 103.45,107.45 J18.2
  Bottom 0.813: v103.3,128.5 105.7,126.1 105.7,109.7 103.45,107.45
A_STEP+_WF  (via drill 0.35)
  Top 0.813: v81.2,103.5 81.2,101.25 R13.2
  Bottom 0.813: v81.2,103.5 83.2,101.5 83.2,83.9 81.1,81.8 J4.2
A_STEP+_X  (via drill 0.35)
  Top 0.813: R5.2 v15.61,128.59 v15.6,128.6
  Bottom 0.813: v15.6,128.6 17.71,126.49 17.71,109.51 J2.2
A_STEP+_Y  (via drill 0.35)
  Top 0.813: R21.2 v37.71,128.59 v37.7,128.6
  Bottom 0.813: v37.7,128.6 39.91,126.39 39.91,109.61 J6.2
A_STEP+_Z  (via drill 0.35)
  Top 0.813: R37.2 v59.91,128.79 v59.9,128.8
  Bottom 0.813: J10.2 62.1,109.8 62.1,126.6 v59.9,128.8
A_STEP-_A  (via drill 0.35)
  Top 0.813: v50,64 LED53.2
  Bottom 0.813: J14.6 v50,64
A_STEP-_C  (via drill 0.35)
  Top 0.813: v103.3,117.7 LED69.2
  Bottom 0.813: J18.6 v103.3,117.7
A_STEP-_WF  (via drill 0.35)
  Top 0.254: 81.17,93.67 LED13.2
  Top 0.813: v81.2,91.6 81.2,93.65 81.17,93.67
  Bottom 0.813: v81.2,91.6 81.2,87.3 J4.6
A_STEP-_X  (via drill 0.35)
  Top 0.813: v15.6,117.8 LED5.2
  Bottom 0.813: J2.6 v15.6,117.8
A_STEP-_Y  (via drill 0.35)
  Top 0.813: v37.7,117.8 LED21.2
  Bottom 0.813: J6.6 v37.7,117.8
A_STEP-_Z  (via drill 0.35)
  Top 0.813: v59.9,118 LED37.2
  Bottom 0.813: v59.9,118 J10.6
B_DIR+_A  (via drill 0.35)
  Top 0.813: v67.9,74.9 R50.2
  Bottom 0.813: J13.3 70.1,55.9 70.1,72.7 v67.9,74.9
B_DIR+_C  (via drill 0.35)
  Top 0.813: R2.2 v98.8,103.2
  Bottom 0.813: J1.3 100.81,83.91 100.81,101.19 v98.8,103.2
B_DIR+_WF  (via drill 0.35)
  Top 0.813: v77.2,128.2 R66.2
  Bottom 0.813: J17.3 79.21,109.01 79.21,126.19 v77.2,128.2
B_DIR+_X  (via drill 0.35)
  Top 0.813: v11.3,102.6 R10.2
  Bottom 0.813: J3.3 13.5,83.6 13.5,100.4 v11.3,102.6
B_DIR+_Y  (via drill 0.35)
  Top 0.813: R18.2 v32.6,102.9
  Bottom 0.813: J5.3 34.5,83.6 34.5,101 v32.6,102.9
B_DIR+_Z  (via drill 0.35)
  Top 0.813: v55.6,102.9 R34.2
  Bottom 0.813: v55.6,102.9 57.61,100.89 57.61,83.71 J9.3
B_DIR-_A  (via drill 0.35)
  Top 0.813: v67.9,64.1 LED50.2
  Bottom 0.254: 67.9,64 v67.9,64.1
  Bottom 0.813: J13.7 67.9,64
B_DIR-_WF  (via drill 0.35)
  Top 0.813: v77.2,117.4 LED66.2
  Bottom 0.813: J17.7 v77.2,117.4
B_DIR-C  (via drill 0.35)
  Top 0.813: v98.7,91.1 LED2.2
  Bottom 0.254: 98.8,87.6 J1.7
  Bottom 0.813: v98.7,91.1 98.8,91 98.8,87.6
B_DIR-X  (via drill 0.35)
  Top 0.813: v11.3,91.8 LED10.2
  Bottom 0.813: J3.7 v11.3,91.8
B_DIR-Y  (via drill 0.35)
  Top 0.813: v32.6,92.1 LED18.2
  Bottom 0.813: v32.6,92.1 J5.7
B_DIR-Z  (via drill 0.35)
  Top 0.813: v55.6,92.1 LED34.2
  Bottom 0.813: J9.7 v55.6,92.1
B_ENABLE+_A  (via drill 0.35)
  Top 0.813: v63.7,75 R51.2
  Bottom 0.813: J13.4 65.8,55.8 65.8,72.9 v63.7,75
B_ENABLE+_C  (via drill 0.35)
  Top 0.813: R3.2 v94.7,103.1
  Bottom 0.813: v94.7,103.1 96.81,100.99 96.81,84.11 J1.4
B_ENABLE+_WF  (via drill 0.35)
  Top 0.813: R67.2 v73,128.3
  Bottom 0.813: J17.4 75.2,109.2 75.2,126.1 v73,128.3
B_ENABLE+_X  (via drill 0.35)
  Top 0.813: R11.2 v7.1,102.7
  Bottom 0.813: v7.1,102.7 9.31,100.49 9.31,83.61 J3.4
B_ENABLE+_Y  (via drill 0.35)
  Top 0.813: R19.2 v28.4,103
  Bottom 0.813: v28.4,103 30.6,100.8 30.6,83.9 J5.4
B_ENABLE+_Z  (via drill 0.35)
  Top 0.813: v51.4,103 R35.2
  Bottom 0.813: J9.4 53.3,83.6 53.3,101.1 v51.4,103
B_ENABLE-_A  (via drill 0.35)
  Top 0.813: v63.7,63.9 LED51.2
  Bottom 0.813: J13.8 v63.7,63.9
B_ENABLE-_C  (via drill 0.35)
  Top 0.813: v94.6,91.3 LED3.2
  Bottom 0.813: J1.8 v94.6,91.3
B_ENABLE-_WF  (via drill 0.35)
  Top 0.813: v73,117.2 LED67.2
  Bottom 0.813: v73,117.2 J17.8
B_ENABLE-_X  (via drill 0.35)
  Top 0.813: v7.1,91.6 LED11.2
  Bottom 0.813: J3.8 v7.1,91.6
B_ENABLE-_Y  (via drill 0.35)
  Top 0.813: v28.4,91.9 LED19.2
  Bottom 0.254: 28.4,91.8 v28.4,91.9
  Bottom 0.813: J5.8 28.4,91.8
B_ENABLE-_Z  (via drill 0.35)
  Top 0.254: 51.4,94.2 LED35.2
  Top 0.813: v51.4,91.9 51.4,94.2
  Bottom 0.254: 51.4,87.3 J9.8
  Bottom 0.813: v51.4,91.9 51.4,87.3
B_HLFB+_A  (via drill 0.35)
  Top 0.813: v76.3,74.9 R52.2
  Bottom 0.813: J13.1 78.3,55.7 78.3,72.9 v76.3,74.9
B_HLFB+_C  (via drill 0.35)
  Top 0.813: R4.2 107.3,103 v107.4,103.1
  Bottom 0.813: J1.1 109.3,84 109.3,101.2 v107.4,103.1
B_HLFB+_WF  (via drill 0.35)
  Top 0.813: v85.6,128.2 R68.2
  Bottom 0.254: 85.7,107.1 J17.1
  Bottom 0.813: 85.7,107.1 87.21,108.61 87.21,126.59 v85.6,128.2
B_HLFB+_X  (via drill 0.35)
  Top 0.813: R12.2 v19.7,102.6
  Bottom 0.813: J3.1 21.5,83.2 21.5,100.8 v19.7,102.6
B_HLFB+_Y  (via drill 0.35)
  Top 0.813: R20.2 v41,102.9
  Bottom 0.813: J5.1 43.2,83.9 43.2,100.7 v41,102.9
B_HLFB+_Z  (via drill 0.35)
  Top 0.813: R36.2 v64,102.9
  Bottom 0.254: 64.1,81.8 J9.1
  Bottom 0.813: v64,102.9 65.61,101.29 65.61,83.31 64.1,81.8
B_HLFB-_A  (via drill 0.35)
  Top 0.813: v76.3,64.1 LED52.2
  Bottom 0.813: J13.5 v76.3,64.1
B_HLFB-_C  (via drill 0.35)
  Top 0.813: v107.2,91.1 107.2,92.65 LED4.2
  Bottom 0.254: 107.2,87.7 J1.5
  Bottom 0.813: v107.2,91.1 107.2,87.7
B_HLFB-_WF  (via drill 0.35)
  Top 0.813: v85.6,117.4 LED68.2
  Bottom 0.813: J17.5 v85.6,117.4
B_HLFB-_X  (via drill 0.35)
  Top 0.813: v19.7,91.8 LED12.2
  Bottom 0.813: J3.5 v19.7,91.8
B_HLFB-_Y  (via drill 0.35)
  Top 0.813: v41,92.1 LED20.2
  Bottom 0.813: v41,92.1 J5.5
B_HLFB-_Z  (via drill 0.35)
  Top 0.813: v64,92.1 LED36.2
  Bottom 0.813: J9.5 v64,92.1
B_STEP+_A  (via drill 0.35)
  Top 0.813: v72.1,74.9 v72.11,74.89 R49.2
  Bottom 0.813: v72.1,74.9 74.31,72.69 74.31,55.91 J13.2
B_STEP+_C  (via drill 0.35)
  Top 0.813: R1.2 v103,103.2
  Bottom 0.254: 103.15,82.05 J1.2
  Bottom 0.813: 103.15,82.05 104.61,83.51 104.61,101.59 v103,103.2
B_STEP+_WF  (via drill 0.35)
  Top 0.813: v81.4,128.2 v81.41,128.19 R65.2
  Bottom 0.813: J17.2 83.7,109.3 83.7,125.9 v81.4,128.2
B_STEP+_X  (via drill 0.35)
  Top 0.813: R9.2 v15.51,102.59 v15.5,102.6
  Bottom 0.813: v15.5,102.6 17.61,100.49 17.61,83.51 J3.2
B_STEP+_Y  (via drill 0.35)
  Top 0.254: v36.81,102.89 v36.8,102.9
  Top 0.813: R17.2 v36.81,102.89
  Bottom 0.254: 36.85,81.75 J5.2
  Bottom 0.813: v36.8,102.9 38.6,101.1 38.6,83.5 36.85,81.75
B_STEP+_Z  (via drill 0.35)
  Top 0.813: v59.8,102.9 v59.81,102.89 R33.2
  Bottom 0.813: v59.8,102.9 61.7,101 61.7,83.6 J9.2
B_STEP-_A  (via drill 0.35)
  Top 0.813: v72.1,64.1 LED49.2
  Bottom 0.813: J13.6 v72.1,64.1
B_STEP-_C  (via drill 0.35)
  Top 0.254: 102.92,92.92 LED1.2
  Top 0.813: v103,91 103,92.85 102.92,92.92
  Bottom 0.813: J1.6 v103,91
B_STEP-_WF  (via drill 0.35)
  Top 0.254: 81.41,119.4 LED65.2
  Top 0.813: v81.4,117.4 81.4,119.39 81.41,119.4
  Bottom 0.254: 81.4,112.6 J17.6
  Bottom 0.813: v81.4,117.4 81.4,112.6
B_STEP-_X  (via drill 0.35)
  Top 0.813: v15.5,91.8 LED9.2
  Bottom 0.813: J3.6 v15.5,91.8
B_STEP-_Y  (via drill 0.35)
  Top 0.813: v36.8,92.1 LED17.2
  Bottom 0.813: J5.6 v36.8,92.1
B_STEP-_Z  (via drill 0.35)
  Top 0.813: v59.8,92.1 LED33.2
  Bottom 0.813: v59.8,92.1 J9.6
BLACK_1
  Top 0.508: R29.P$1 R28.P$1 | R28.P$1 | J12.P$3 5.98,65.98 7.45,67.45 R28.P$1
  Bottom 0.508: J11.2 17.75,68.75 16.5,67.5 8.3,67.5 6.78,65.98 J12.P$3
BLACK_2
  Top 0.508: R43.P$1 R42.P$1 | R42.P$1 | J20.P$3 5.98,48.68 7.45,50.15 R42.P$1
  Bottom 0.508: J19.2 17.75,51.45 16.5,50.2 8.3,50.2 6.78,48.68 J20.P$3
BLACK_3
  Top 0.508: R57.P$1 R48.P$1 | R48.P$1 | J24.P$3 5.88,31.08 7.35,32.55 R48.P$1
  Bottom 0.508: J23.2 17.66,33.85 16.4,32.6 8.2,32.6 6.68,31.08 J24.P$3
BLACK_4
  Top 0.508: R64.P$1 R63.P$1 | R63.P$1 | J28.P$3 5.88,13.48 7.35,14.95 R63.P$1
  Bottom 0.508: J27.2 17.66,16.25 16.4,15 8.2,15 6.68,13.48 J28.P$3
BLACK_5
  Top 0.508: R78.P$1 R77.P$1 | R77.P$1 | J32.P$3 32.42,5.78 30.95,7.25 R77.P$1
  Bottom 0.508: J31.2 29.64,17.55 30.9,16.3 30.9,8.1 32.42,6.58 J32.P$3
BLACK_6
  Top 0.508: R84.P$1 R83.P$1 | R83.P$1 | J36.P$3 49.92,5.88 48.45,7.35 R83.P$1
  Bottom 0.508: J35.2 47.15,17.66 48.4,16.4 48.4,8.2 49.92,6.68 J36.P$3
BLACK_7
  Top 0.508: R90.P$1 R89.P$1 | R89.P$1 | J40.P$3 67.42,5.88 65.95,7.35 R89.P$1
  Bottom 0.508: J39.2 64.64,17.66 65.9,16.4 65.9,8.2 67.42,6.68 J40.P$3
BLACK_8
  Top 0.508: R96.P$1 R95.P$1 | R95.P$1 | J44.P$3 84.42,5.78 82.95,7.25 R95.P$1
  Bottom 0.508: J43.2 81.64,17.55 82.9,16.3 82.9,8.1 84.42,6.58 J44.P$3
BLACK_9
  Top 0.508: R102.P$1 R101.P$1 | R101.P$1 | J48.P$3 102.02,5.78 100.55,7.25 R101.P$1
  Bottom 0.508: J47.2 99.25,17.55 100.5,16.3 100.5,8.1 102.02,6.58 J48.P$3
BLACK_E_STOP
  Top 0.508: R108.P$1 R107.P$1 | R107.P$1 | J52.P$3 109.02,32.42 107.55,30.95 R107.P$1
  Bottom 0.508: J51.2 97.25,29.64 98.5,30.9 106.7,30.9 108.22,32.42 J52.P$3
BLUE  (9 unrouted)
  Top 0.508: SW2.4 SW2.3 7.97,69.62 7,70.6 7,72.6 6,73.6 J12.P$1 | SW4.4 SW4.3 7.97,52.33 7,53.3 7,55.3 6,56.3 J20.P$1 | SW6.4 SW6.3 7.88,34.73 6.9,35.7 6.9,37.7 5.9,38.7 J24.P$1 | SW8.4 SW8.3 7.88,17.12 6.9,18.1 6.9,20.1 5.9,21.1 J28.P$1 | SW10.4 SW10.3 28.77,7.78 27.8,6.8 25.8,6.8 24.8,5.8 J32.P$1 | SW12.4 SW12.3 46.27,7.88 45.3,6.9 43.3,6.9 42.3,5.9 J36.P$1 | SW14.4 SW14.3 63.77,7.88 62.8,6.9 60.8,6.9 59.8,5.9 J40.P$1 | SW16.4 SW16.3 80.78,7.78 79.8,6.8 77.8,6.8 76.8,5.8 J44.P$1 | SW18.4 SW18.3 98.38,7.78 97.4,6.8 95.4,6.8 94.4,5.8 J48.P$1 | SW20.4 SW20.3 107.03,28.77 108,27.8 108,25.8 109,24.8 J52.P$1
  Bottom 0.508: J11.1 17.4,70 17.1,69.7 4.09,69.7 J12.P$2 J12.P$1 | J19.1 17.4,52.7 17.1,52.4 4.09,52.4 J20.P$2 J20.P$1 | J23.1 17.3,35.1 17,34.8 3.99,34.8 J24.P$2 J24.P$1 | J27.1 17.3,17.5 17,17.2 3.99,17.2 J28.P$2 J28.P$1 | J31.1 28.4,17.2 28.7,16.9 28.7,3.89 J32.P$2 J32.P$1 | J35.1 45.9,17.3 46.2,17 46.2,3.99 J36.P$2 J36.P$1 | J39.1 63.4,17.3 63.7,17 63.7,3.99 J40.P$2 J40.P$1 | J43.1 80.4,17.2 80.7,16.9 80.7,3.89 J44.P$2 J44.P$1 | J47.1 98,17.2 98.3,16.9 98.3,3.89 J48.P$2 J48.P$1 | J51.1 97.6,28.4 97.9,28.7 110.91,28.7 J52.P$2 J52.P$1
  pour Top (no thermals): 0,0 0,135 115,135 115,0
  pour Bottom (no thermals): 0,0 0,135 115,135 115,0
BROWN  (9 unrouted)
  Top 0.508: U1.3 9.95,66.1 R27.P$1 8.1,66.1 7.2,65.2 7.2,64 5.37,62.17 J12.P$4 | U3.3 9.95,48.8 R41.P$1 8.1,48.8 7.2,47.9 7.2,46.7 5.37,44.87 J20.P$4 | U5.3 9.85,31.2 R47.P$1 8,31.2 7.1,30.3 7.1,29.1 5.27,27.27 J24.P$4 | U7.3 9.85,13.6 R62.P$1 8,13.6 7.1,12.7 7.1,11.5 5.27,9.67 J28.P$4 | U9.3 32.3,9.75 R76.P$1 32.3,7.9 33.2,7 34.4,7 36.23,5.17 J32.P$4 | U11.3 49.8,9.85 R82.P$1 49.8,8 50.7,7.1 51.9,7.1 53.73,5.27 J36.P$4 | U13.3 67.3,9.85 R88.P$1 67.3,8 68.2,7.1 69.4,7.1 71.23,5.27 J40.P$4 | U15.3 84.3,9.75 R94.P$1 84.3,7.9 85.2,7 86.4,7 88.23,5.17 J44.P$4 | U17.3 101.9,9.75 R100.P$1 101.9,7.9 102.8,7 104,7 105.83,5.17 J48.P$4 | U20.3 105.05,32.3 R106.P$1 106.9,32.3 107.8,33.2 107.8,34.4 109.63,36.23 J52.P$4
  Bottom 0.508: J11.3 17.79,66.3 10.7,66.3 6.57,62.17 J12.P$4 | J19.3 17.79,49 10.7,49 6.57,44.87 J20.P$4 | J23.3 17.69,31.4 10.6,31.4 6.47,27.27 J24.P$4 | J27.3 17.69,13.8 10.6,13.8 6.47,9.67 J28.P$4 | J31.3 32.1,17.59 32.1,10.5 36.23,6.37 J32.P$4 | J35.3 49.6,17.69 49.6,10.6 53.73,6.47 J36.P$4 | J39.3 67.1,17.69 67.1,10.6 71.23,6.47 J40.P$4 | J43.3 84.1,17.59 84.1,10.5 88.23,6.37 J44.P$4 | J47.3 101.7,17.59 101.7,10.5 105.83,6.37 J48.P$4 | J51.3 97.21,32.1 104.3,32.1 108.43,36.23 J52.P$4
N$1
  Top 0.254: 102.9,98.8 102.9,98.95 R1.1
  Top 0.813: LED1.1 102.9,98.8
N$2
  Top 0.813: LED2.1 98.7,98.95 R2.1
N$3
  Top 0.813: LED3.1 94.6,98.95 R3.1
N$4
  Top 0.813: LED4.1 R4.1
N$5
  Top 0.813: LED5.1 R5.1
N$6
  Top 0.813: R6.1 LED6.1
N$7
  Top 0.813: LED7.1 R7.1
N$8
  Top 0.813: R8.1 LED8.1
N$9
  Top 0.813: LED9.1 R9.1
N$10
  Top 0.254: 11.3,96.1 LED10.1
  Top 0.813: R10.1 11.3,96.1
N$11
  Top 0.813: LED11.1 R11.1
N$12
  Top 0.813: LED12.1 R12.1
N$13
  Top 0.813: LED13.1 R13.1
N$14
  Top 0.813: R14.1 LED14.1
N$15
  Top 0.813: R15.1 LED15.1
N$16
  Top 0.813: LED16.1 R16.1
N$17
  Top 0.813: LED17.1 R17.1
N$18
  Top 0.813: LED18.1 R18.1
N$19
  Top 0.254: 28.4,98.8 R19.1
  Top 0.813: LED19.1 28.4,98.8
N$20
  Top 0.813: LED20.1 R20.1
N$21
  Top 0.813: LED21.1 R21.1
N$22
  Top 0.254: 33.5,124.4 R22.1
  Top 0.813: LED22.1 33.5,124.4
N$23
  Top 0.254: R23.1 LED23.1
N$24
  Top 0.813: LED24.1 R24.1
N$28
  Top 0.508: U1.1 13.81,65.01 | LED25.1 15.3,66.5 13.81,65.01 | R27.P$2 9.3,64.2 13,64.2 13.81,65.01
N$29
  Top 0.508: SW2.1 SW2.2 13.5,71.15 13.8,71.15 | 13.8,71.15 LED25.2 | R29.P$2 13.51,68.41 13.9,68.8 13.9,71.05 13.8,71.15
N$30
  Top 0.508: U1.2 12.86,67.02 R28.P$2
N$33
  Top 0.813: R33.1 LED33.1
N$34
  Top 0.813: R34.1 LED34.1
N$35
  Top 0.813: LED35.1 R35.1
N$36
  Top 0.813: LED36.1 R36.1
N$37
  Top 0.813: LED37.1 R37.1
N$38
  Top 0.813: R38.1 LED38.1
N$39
  Top 0.813: LED39.1 R39.1
N$40
  Top 0.813: R40.1 LED40.1
N$42
  Top 0.508: U3.1 13.81,47.71 | LED28.1 15.3,49.2 13.81,47.71 | R41.P$2 9.3,46.9 13,46.9 13.81,47.71
N$43
  Top 0.508: SW4.1 SW4.2 13.5,53.85 13.8,53.85 | 13.8,53.85 LED28.2 | R43.P$2 13.51,51.11 13.9,51.5 13.9,53.75 13.8,53.85
N$44
  Top 0.508: U3.2 12.86,49.72 R42.P$2
N$48
  Top 0.508: U5.1 13.71,30.11 | LED30.1 15.2,31.6 13.71,30.11 | R47.P$2 9.2,29.3 12.9,29.3 13.71,30.11
N$49
  Top 0.813: R49.1 LED49.1
N$50
  Top 0.813: LED50.1 R50.1
N$51
  Top 0.813: R51.1 LED51.1
N$52
  Top 0.813: LED52.1 R52.1
N$53
  Top 0.813: LED53.1 R53.1
N$54
  Top 0.813: R54.1 LED54.1
N$55
  Top 0.813: LED55.1 R55.1
N$56
  Top 0.813: LED56.1 R56.1
N$57
  Top 0.508: SW6.1 SW6.2 13.4,36.25 13.7,36.25 | 13.7,36.25 LED30.2 | R57.P$2 13.41,33.51 13.8,33.9 13.8,36.15 13.7,36.25
N$58
  Top 0.508: U5.2 12.76,32.12 R48.P$2
N$62
  Top 0.508: U7.1 13.71,12.51 | LED32.1 15.2,14 13.71,12.51 | R62.P$2 9.2,11.7 12.9,11.7 13.71,12.51
N$63
  Top 0.508: SW8.1 SW8.2 13.4,18.65 13.7,18.65 | 13.7,18.65 LED32.2 | R64.P$2 13.41,15.91 13.8,16.3 13.8,18.55 13.7,18.65
N$64
  Top 0.508: U7.2 12.76,14.52 R63.P$2
N$65
  Top 0.813: LED65.1 R65.1
N$66
  Top 0.813: R66.1 LED66.1
N$67
  Top 0.813: LED67.1 R67.1
N$68
  Top 0.813: R68.1 LED68.1
N$69
  Top 0.813: LED69.1 R69.1
N$70
  Top 0.813: LED70.1 R70.1
N$71
  Top 0.813: LED71.1 R71.1
N$72
  Top 0.813: LED72.1 R72.1
N$76
  Top 0.508: U9.1 33.39,13.61 | LED42.1 31.9,15.1 33.39,13.61 | R76.P$2 34.2,9.1 34.2,12.8 33.39,13.61
N$77
  Top 0.508: SW10.1 SW10.2 27.25,13.3 27.25,13.6 | 27.25,13.6 LED42.2 | R78.P$2 29.99,13.31 29.6,13.7 27.35,13.7 27.25,13.6
N$78
  Top 0.508: U9.2 31.38,12.66 R77.P$2
N$82
  Top 0.508: U11.1 50.89,13.71 | LED44.1 49.4,15.2 50.89,13.71 | R82.P$2 51.7,9.2 51.7,12.9 50.89,13.71
N$83
  Top 0.508: SW12.1 SW12.2 44.75,13.4 44.75,13.7 | 44.75,13.7 LED44.2 | R84.P$2 47.49,13.41 47.1,13.8 44.85,13.8 44.75,13.7
N$84
  Top 0.508: U11.2 48.88,12.76 R83.P$2
N$88
  Top 0.508: U13.1 68.39,13.71 | LED46.1 66.9,15.2 68.39,13.71 | R88.P$2 69.2,9.2 69.2,12.9 68.39,13.71
N$89
  Top 0.508: SW14.1 SW14.2 62.25,13.4 62.25,13.7 | 62.25,13.7 LED46.2 | R90.P$2 64.99,13.41 64.6,13.8 62.35,13.8 62.25,13.7
N$90
  Top 0.508: U13.2 66.38,12.76 R89.P$2
N$94
  Top 0.508: U15.1 85.39,13.61 | LED48.1 83.9,15.1 85.39,13.61 | R94.P$2 86.2,9.1 86.2,12.8 85.39,13.61
N$95
  Top 0.508: SW16.1 SW16.2 79.25,13.3 79.25,13.6 | 79.25,13.6 LED48.2 | R96.P$2 81.99,13.31 81.6,13.7 79.35,13.7 79.25,13.6
N$96
  Top 0.508: U15.2 83.38,12.66 R95.P$2
N$100
  Top 0.508: U17.1 102.99,13.61 | LED58.1 101.5,15.1 102.99,13.61 | R100.P$2 103.8,9.1 103.8,12.8 102.99,13.61
N$101
  Top 0.508: SW18.1 SW18.2 96.85,13.3 96.85,13.6 | 96.85,13.6 LED58.2 | R102.P$2 99.59,13.31 99.2,13.7 96.95,13.7 96.85,13.6
N$102
  Top 0.508: U17.2 100.98,12.66 R101.P$2
N$106
  Top 0.508: U20.1 101.19,33.39 | LED60.1 99.7,31.9 101.19,33.39 | R106.P$2 105.7,34.2 102,34.2 101.19,33.39
N$107
  Top 0.508: SW20.1 SW20.2 101.5,27.25 101.2,27.25 | 101.2,27.25 LED60.2 | R108.P$2 101.49,29.99 101.1,29.6 101.1,27.35 101.2,27.25
N$108
  Top 0.508: U20.2 102.14,31.38 R107.P$2

### Text on the board
tPlace: X | z | Y | A | C | A | B | A | B | WF